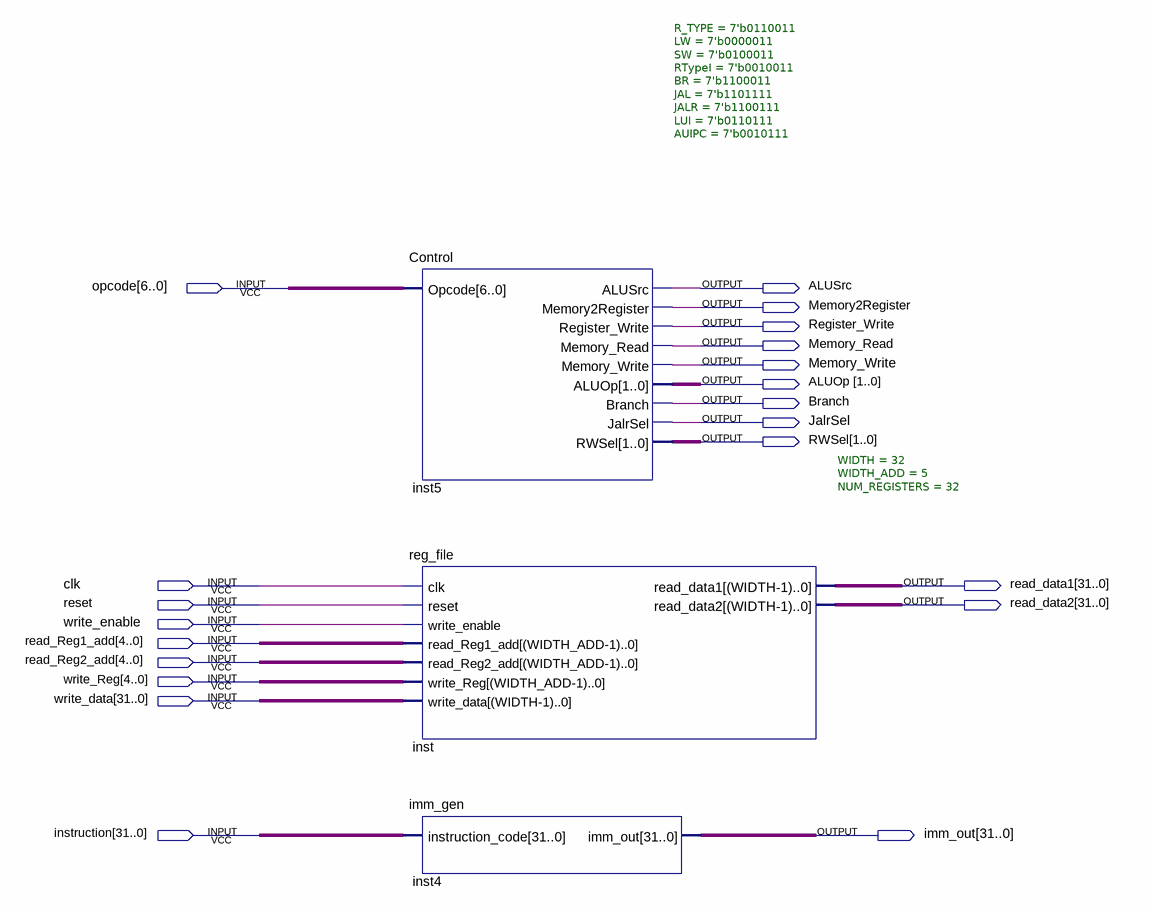
[diagram p0: schematic sheet]
// Quartus schematic decode.bdf as structural Verilog: 3 symbols, 21 pins
module decode (
  input  [6:0] opcode,
  input  clk,
  input  reset,
  input  write_enable,
  input  [4:0] read_Reg1_add,
  input  [4:0] read_Reg2_add,
  input  [4:0] write_Reg,
  input  [31:0] write_data,
  input  [31:0] instruction,
  output ALUSrc,
  output Memory2Register,
  output Register_Write,
  output Memory_Read,
  output Memory_Write,
  output [1:0] ALUOp,
  output Branch,
  output JalrSel,
  output [1:0] RWSel,
  output [31:0] read_data1,
  output [31:0] read_data2,
  output [31:0] imm_out
);

  Control #(.R_TYPE(7'b0110011), .LW(7'b0000011), .SW(7'b0100011), .RTypeI(7'b0010011), .BR(7'b1100011), .JAL(7'b1101111), .JALR(7'b1100111), .LUI(7'b0110111), .AUIPC(7'b0010111)) inst5 (
    .Opcode(opcode), .ALUSrc(ALUSrc), .Memory2Register(Memory2Register), .Register_Write(Register_Write),
    .Memory_Read(Memory_Read), .Memory_Write(Memory_Write), .ALUOp(ALUOp), .Branch(Branch),
    .JalrSel(JalrSel), .RWSel(RWSel));
  reg_file #(.WIDTH(32), .WIDTH_ADD(5), .NUM_REGISTERS(32)) inst (
    .clk(clk), .reset(reset), .write_enable(write_enable), .read_Reg1_add(read_Reg1_add),
    .read_Reg2_add(read_Reg2_add), .write_Reg(write_Reg), .write_data(write_data), .read_data1(read_data1),
    .read_data2(read_data2));
  imm_gen inst4 (.instruction_code(instruction), .imm_out(imm_out));
endmodule
